# Altium schematic sheet peripherals.SchDoc
size A portrait; SheetNumber: 2; SheetTotal: 3
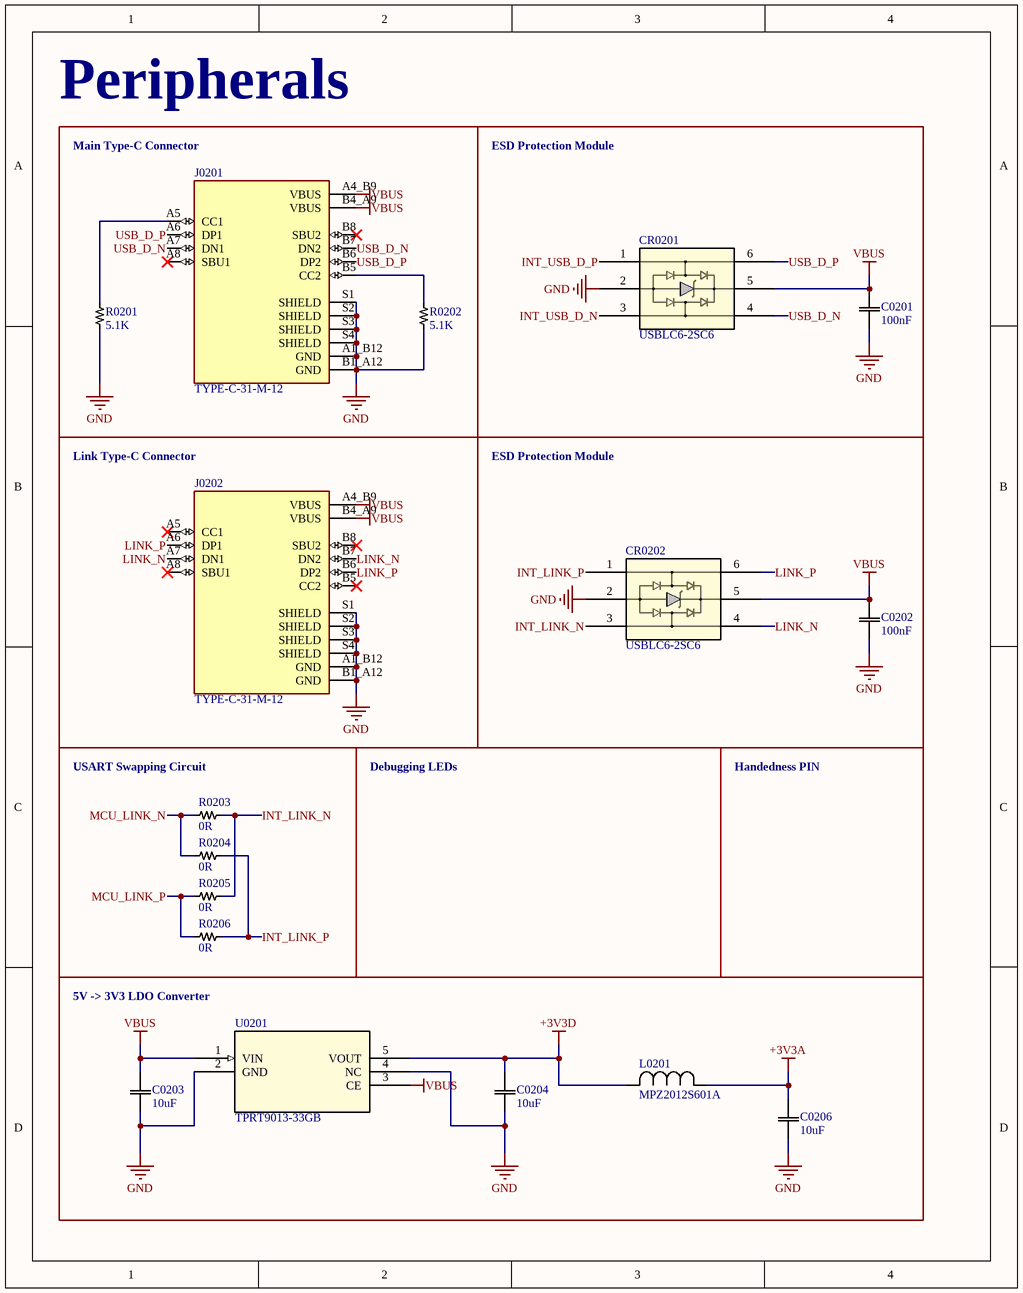
[diagram p0: peripherals.SchDoc]

## Parts
C0201  100nF  [CAPC10555_55N_KEM]
C0202  100nF  [CAPC10555_55N_KEM]
C0203  10uF  [CAPC10555_55N_KEM]
C0204  10uF  [CAPC10555_55N_KEM]
C0206  10uF  [CAPC10555_55N_KEM]
CR0201  USBLC6-2SC6  [SOT23-6L_STM]
CR0202  USBLC6-2SC6  [SOT23-6L_STM]
J0201  TYPE-C-31-M-12  [HRO_TYPE-C-31-M-12]
J0202  TYPE-C-31-M-12  [HRO_TYPE-C-31-M-12]
L0201  MPZ2012S601A  [IND_MPZ2012_TDK]
R0201  5.1K  [RES0402_CPF_TYCO_TYC]
R0202  5.1K  [RES0402_CPF_TYCO_TYC]
R0203  0R  [RES0402_CPF_TYCO_TYC]
R0204  0R  [RES0402_CPF_TYCO_TYC]
R0205  0R  [RES0402_CPF_TYCO_TYC]
R0206  0R  [RES0402_CPF_TYCO_TYC]
U0201  TPRT9013-33GB  [SOT23-5_TCP]

## Blocks framed on the sheet
Peripherals: J0201 R0201 R0202
ESD Protection Module: C0201 CR0201
Link Type-C Connector: J0202
ESD Protection Module: C0202 CR0202
5V -> 3V3 LDO Converter: C0203 C0204 C0206 L0201 U0201

## Nets
+3V3A: C0206.2 L0201.1
+3V3D: C0204.2 L0201.2 U0201.5(VOUT)
GND: C0201.1 C0202.1 C0203.1 C0204.1 C0206.1 CR0201.2 CR0202.2 J0201.A1_B12(GND) J0201.B1_A12(GND) J0201.S1(SHIELD) J0201.S2(SHIELD) J0201.S3(SHIELD) J0201.S4(SHIELD) J0202.A1_B12(GND) J0202.B1_A12(GND) J0202.S1(SHIELD) J0202.S2(SHIELD) J0202.S3(SHIELD) J0202.S4(SHIELD) R0201.1 R0202.1 U0201.2(GND) U0201.4(NC)
VBUS: C0201.2 C0202.2 C0203.2 CR0201.5 CR0202.5 J0201.A4_B9(VBUS) J0201.B4_A9(VBUS) J0202.A4_B9(VBUS) J0202.B4_A9(VBUS) U0201.1(VIN) U0201.3(CE)
INT_LINK_N: CR0202.3 R0203.1 R0205.1
INT_LINK_P: CR0202.1 R0204.1 R0206.1
INT_USB_D_N: CR0201.3
INT_USB_D_P: CR0201.1
LINK_N: CR0202.4 J0202.A7(DN1) J0202.B7(DN2)
LINK_P: CR0202.6 J0202.A6(DP1) J0202.B6(DP2)
MCU_LINK_N: R0203.2 R0204.2
MCU_LINK_P: R0205.2 R0206.2
USB_D_N: CR0201.4 J0201.A7(DN1) J0201.B7(DN2)
USB_D_P: CR0201.6 J0201.A6(DP1) J0201.B6(DP2)
NetJ0201_A5: J0201.A5(CC1) R0201.2
NetJ0201_B5: J0201.B5(CC2) R0202.2

Not connected (* = marked no-connect by the designer): J0201 A8(SBU1)* B8(SBU2)*; J0202 A5(CC1)* A8(SBU1)* B5(CC2)* B8(SBU2)*

## Notes on the sheet
- (near J0201) Main Type-C Connector
- (near R0203) USART Swapping Circuit
- Debugging LEDs
- Handedness PIN

## Library data of the parts
C0201 C0202 C0203 C0204 C0206 = C0402: SMD Comm X7R, Ceramic, SMD, MLCC, Temperature Stable, 0402; Manufacturer_Name: Kemet; Manufacturer_Part_Number: C0402C104K4RACTU; Copyright: Copyright (C) 2025 Ultra Librarian. All rights reserved.; Datasheet: https://content.kemet.com/datasheets/KEM_C1002_X7R_SMD.pdf
CR0201 CR0202 = USBLC6-2SC6: ESD Protection for USB 2.0 High Speed; Manufacturer_Name: STMicroelectronics; Copyright: Copyright (C) 2025 Ultra Librarian. All rights reserved.; Manufacturer_Part_Number: USBLC6-2SC6; Datasheet: https://www.st.com/resource/en/datasheet/usblc6-2.pdf; RefDes: RefDes; Type: Type
J0201 J0202 = TYPE-C-31-M-12: USB Connectors 24 Receptacle 1 8.94*7.3mm RoHS; MF: HRO Electronics Co., Ltd.; SnapEDA_Link: https://www.snapeda.com/parts/TYPE-C-31-M-12/HRO+Electronics+Co.%252C+Ltd./view-part/?ref=snap; Package: Package; Value: *; MP: TYPE-C-31-M-12; Check_prices: https://www.snapeda.com/parts/TYPE-C-31-M-12/HRO+Electronics+Co.%252C+Ltd./view-part/?ref=eda
L0201 = MPZ2012S601A: No Description Available; Manufacturer_Name: TDK; Copyright: Copyright (C) 2025 Ultra Librarian. All rights reserved.; Manufacturer_Part_Number: MPZ2012S601A
R0201 R0202 R0203 R0204 R0205 R0206 = R0402: CPF 0402 RL; Manufacturer_Name: TE Connectivity; Manufacturer_Part_Number: CPF0402B33RE1; Copyright: Copyright (C) 2025 Ultra Librarian. All rights reserved.; Datasheet: https://www.te.com/commerce/DocumentDelivery/DDEController?Action=srchrtrv&DocNm=1773200&DocType=Data+Sheet&DocLang=English&PartCntxt=1-1879208-3&DocFormat=pdf
U0201 = TPRT9013-33GB: No Description Available; Manufacturer_Name: Tech Public; Type: Power Management; Copyright: Copyright (C) 2025 Ultra Librarian. All rights reserved.; Manufacturer_Part_Number: TPRT9013-33GB; RefDes: RefDes